# Altium schematic sheet CAN_MCP_CTRL&TXRX.SchDoc
size A4
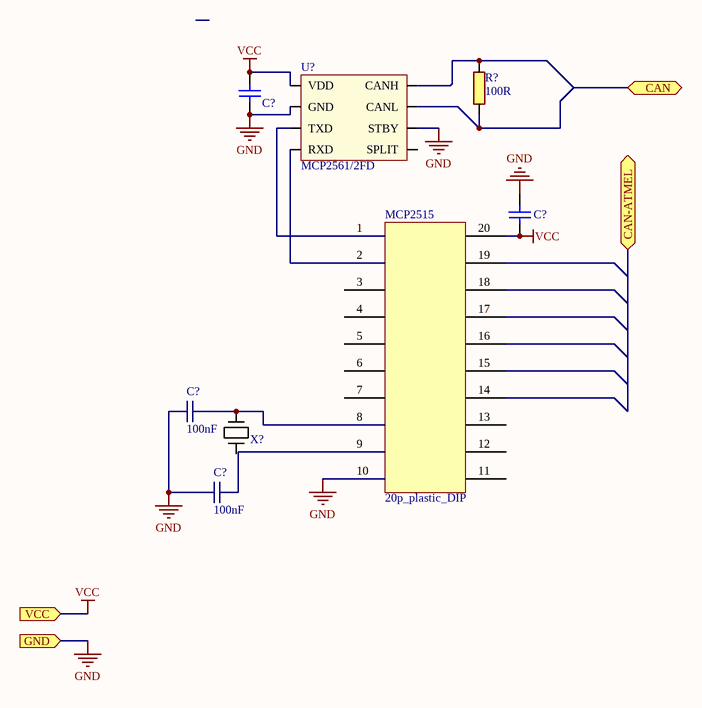
[diagram p0: CAN_MCP_CTRL&TXRX.SchDoc]

## Parts
(Parts that share a designator on the sheet are numbered #1, #2 ... from top to bottom, then left to right.)
C?#1  0603 Cap  [0603 Capacitor]  (value not drawn)
C?#2  0603 Cap  [0603 Capacitor]  (value not drawn)
C?#3  100nF  [CAPC0603(1608)55_N]
C?#4  100nF  [CAPC0603(1608)55_N]
MCP2515  20p_plastic_DIP  [20p_plastic_DIP]
R?  100R  [RESC0603(1608)_N]
U?  MCP2561/2FD  [SOIC127P600X175-8N]
X?  ABM3-16.000MHZ-D2Y-T  [CRYSTAL-ABM7]  (value not drawn)

## Ports
CAN (bidir), CAN-ATMEL, GND (in), VCC (in)

## Nets
GND: C?#1.2 C?#2.1 C?#3.2 C?#4.2 MCP2515.10 U?.2(GND) U?.8(STBY) ; port GND
VCC: C?#1.1 C?#2.2 MCP2515.20 U?.3(VDD) ; port VCC
NetC?#3_1: C?#3.1 MCP2515.8 X?.2
NetC?#4_1: C?#4.1 MCP2515.9
NetMCP2515_1: MCP2515.1 U?.1(TXD)
NetMCP2515_2: MCP2515.2 U?.4(RXD)
NetR?_1: R?.1 U?.6(CANL)
NetR?_2: R?.2 U?.7(CANH)

Not connected (* = marked no-connect by the designer): MCP2515 3 4 5 6 7 11 12 13 14 15 16 17 18 19; U? 5(SPLIT); X? 1

## Library data of the parts
C?#1 C?#2 = CMP-001-A20-6: value: *
C?#3 C?#4 = 3934: Capacitor; id: 3934; pakke_opprettet_av: 815; navn: 220nF; pris: 0; nokkelord: kondensator; pakketype: 0603; pakke_opprettet: 18.02.2015 14:18:13; symbol_opprettet_av: 815; symbol_opprettet: 14.11.2014 20:19:34
R? = 2384: 0.1W 1% Thick film resistor; id: 2384; rad: -1; rom: OV; lager_type: Fremlager; dybde: 96; hylle: 2; antall: 100; kolonne: 0; pakke_opprettet_av: 815; navn: 100k; pakketype: 0603; pakke_opprettet: 08.07.2014 21:15:30; symbol_opprettet_av: 815; symbol_opprettet: 08.07.2014 21:16:33; pris: 0; nokkelord: Resistor
U? = CMP-001-D35-2: CAN tranciever with CAN-FD optimization,  microchip technology
X? = 4474: id: 4474; rad: 2; rom: OV; lager_type: Fremlager; dybde: 4; hylle: 7; antall: 10; pakke_opprettet_av: 774; beskrivelse: Krystall 16MHz 18pF, 5*3.2,  ABM3, 30ppm; leverandor_varenr: 2467791; nokkelord: Krystall 16MHz 18pF  ABM3,30ppm 16 MHz; leverandor: Farnell; pakketype: SMD; pakke_opprettet: 23.08.2014 20:10:40; symbol_opprettet_av: 774; symbol_opprettet: 23.08.2014 20:23:20; navn: ABM3-16.000MHZ-D2Y-T; pris: 10